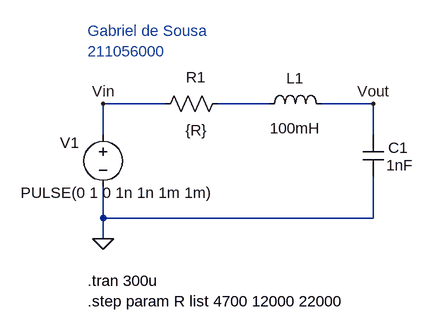
[diagram p0: schematic item_4.asc]
item_4.asc, the LTspice schematic file:
Version 4.1
SHEET 1 880 680
WIRE 224 32 128 32
WIRE 384 32 304 32
WIRE 544 32 464 32
WIRE 128 80 128 32
WIRE 544 80 544 32
WIRE 128 208 128 160
WIRE 544 208 544 144
WIRE 544 208 128 208
WIRE 128 240 128 208
FLAG 128 240 0
FLAG 128 32 Vin
FLAG 544 32 Vout
SYMBOL voltage 128 64 R0
WINDOW 0 -66 28 Left 2
WINDOW 3 -127 105 Left 2
WINDOW 123 -73 62 Left 0
WINDOW 39 0 0 Left 0
SYMATTR InstName V1
SYMATTR Value PULSE(0 1 0 1n 1n 1m 1m)
SYMBOL res 320 16 R90
WINDOW 0 -9 49 VBottom 2
WINDOW 3 41 48 VTop 2
SYMATTR InstName R1
SYMATTR Value {R}
SYMBOL cap 528 80 R0
WINDOW 0 39 20 Left 2
WINDOW 3 36 47 Left 2
SYMATTR InstName C1
SYMATTR Value 1nF
SYMBOL ind 368 48 R270
WINDOW 0 40 56 VTop 2
WINDOW 3 -6 56 VBottom 2
SYMATTR InstName L1
SYMATTR Value 100mH
SYMATTR SpiceLine Rser=1m
TEXT 104 -80 Left 2 ;Gabriel de Sousa\n211056000
TEXT 104 304 Left 2 !.tran 300u
TEXT 104 336 Left 2 !.step param R list 4700 12000 22000

The netlist it stands for:
* item_4.asc
V1 Vin 0 PULSE(0 1 0 1n 1n 1m 1m)
R1 N001 Vin {R}
C1 Vout 0 1nF
L1 N001 Vout 100mH Rser=1m
* Gabriel de Sousa
* 211056000
.tran 300u
.step param R list 4700 12000 22000
.backanno
.end